# EasyEDA schematic SCH_RE2e-YM2151-v0.4_2024-08-24.json

## Sheets
1 BUS: TITLE: Sheet_2; REV: 1.0; Date: 2024-01-08; Sheet: 1/1; Drawn By: Denjhang; Company: Your Company
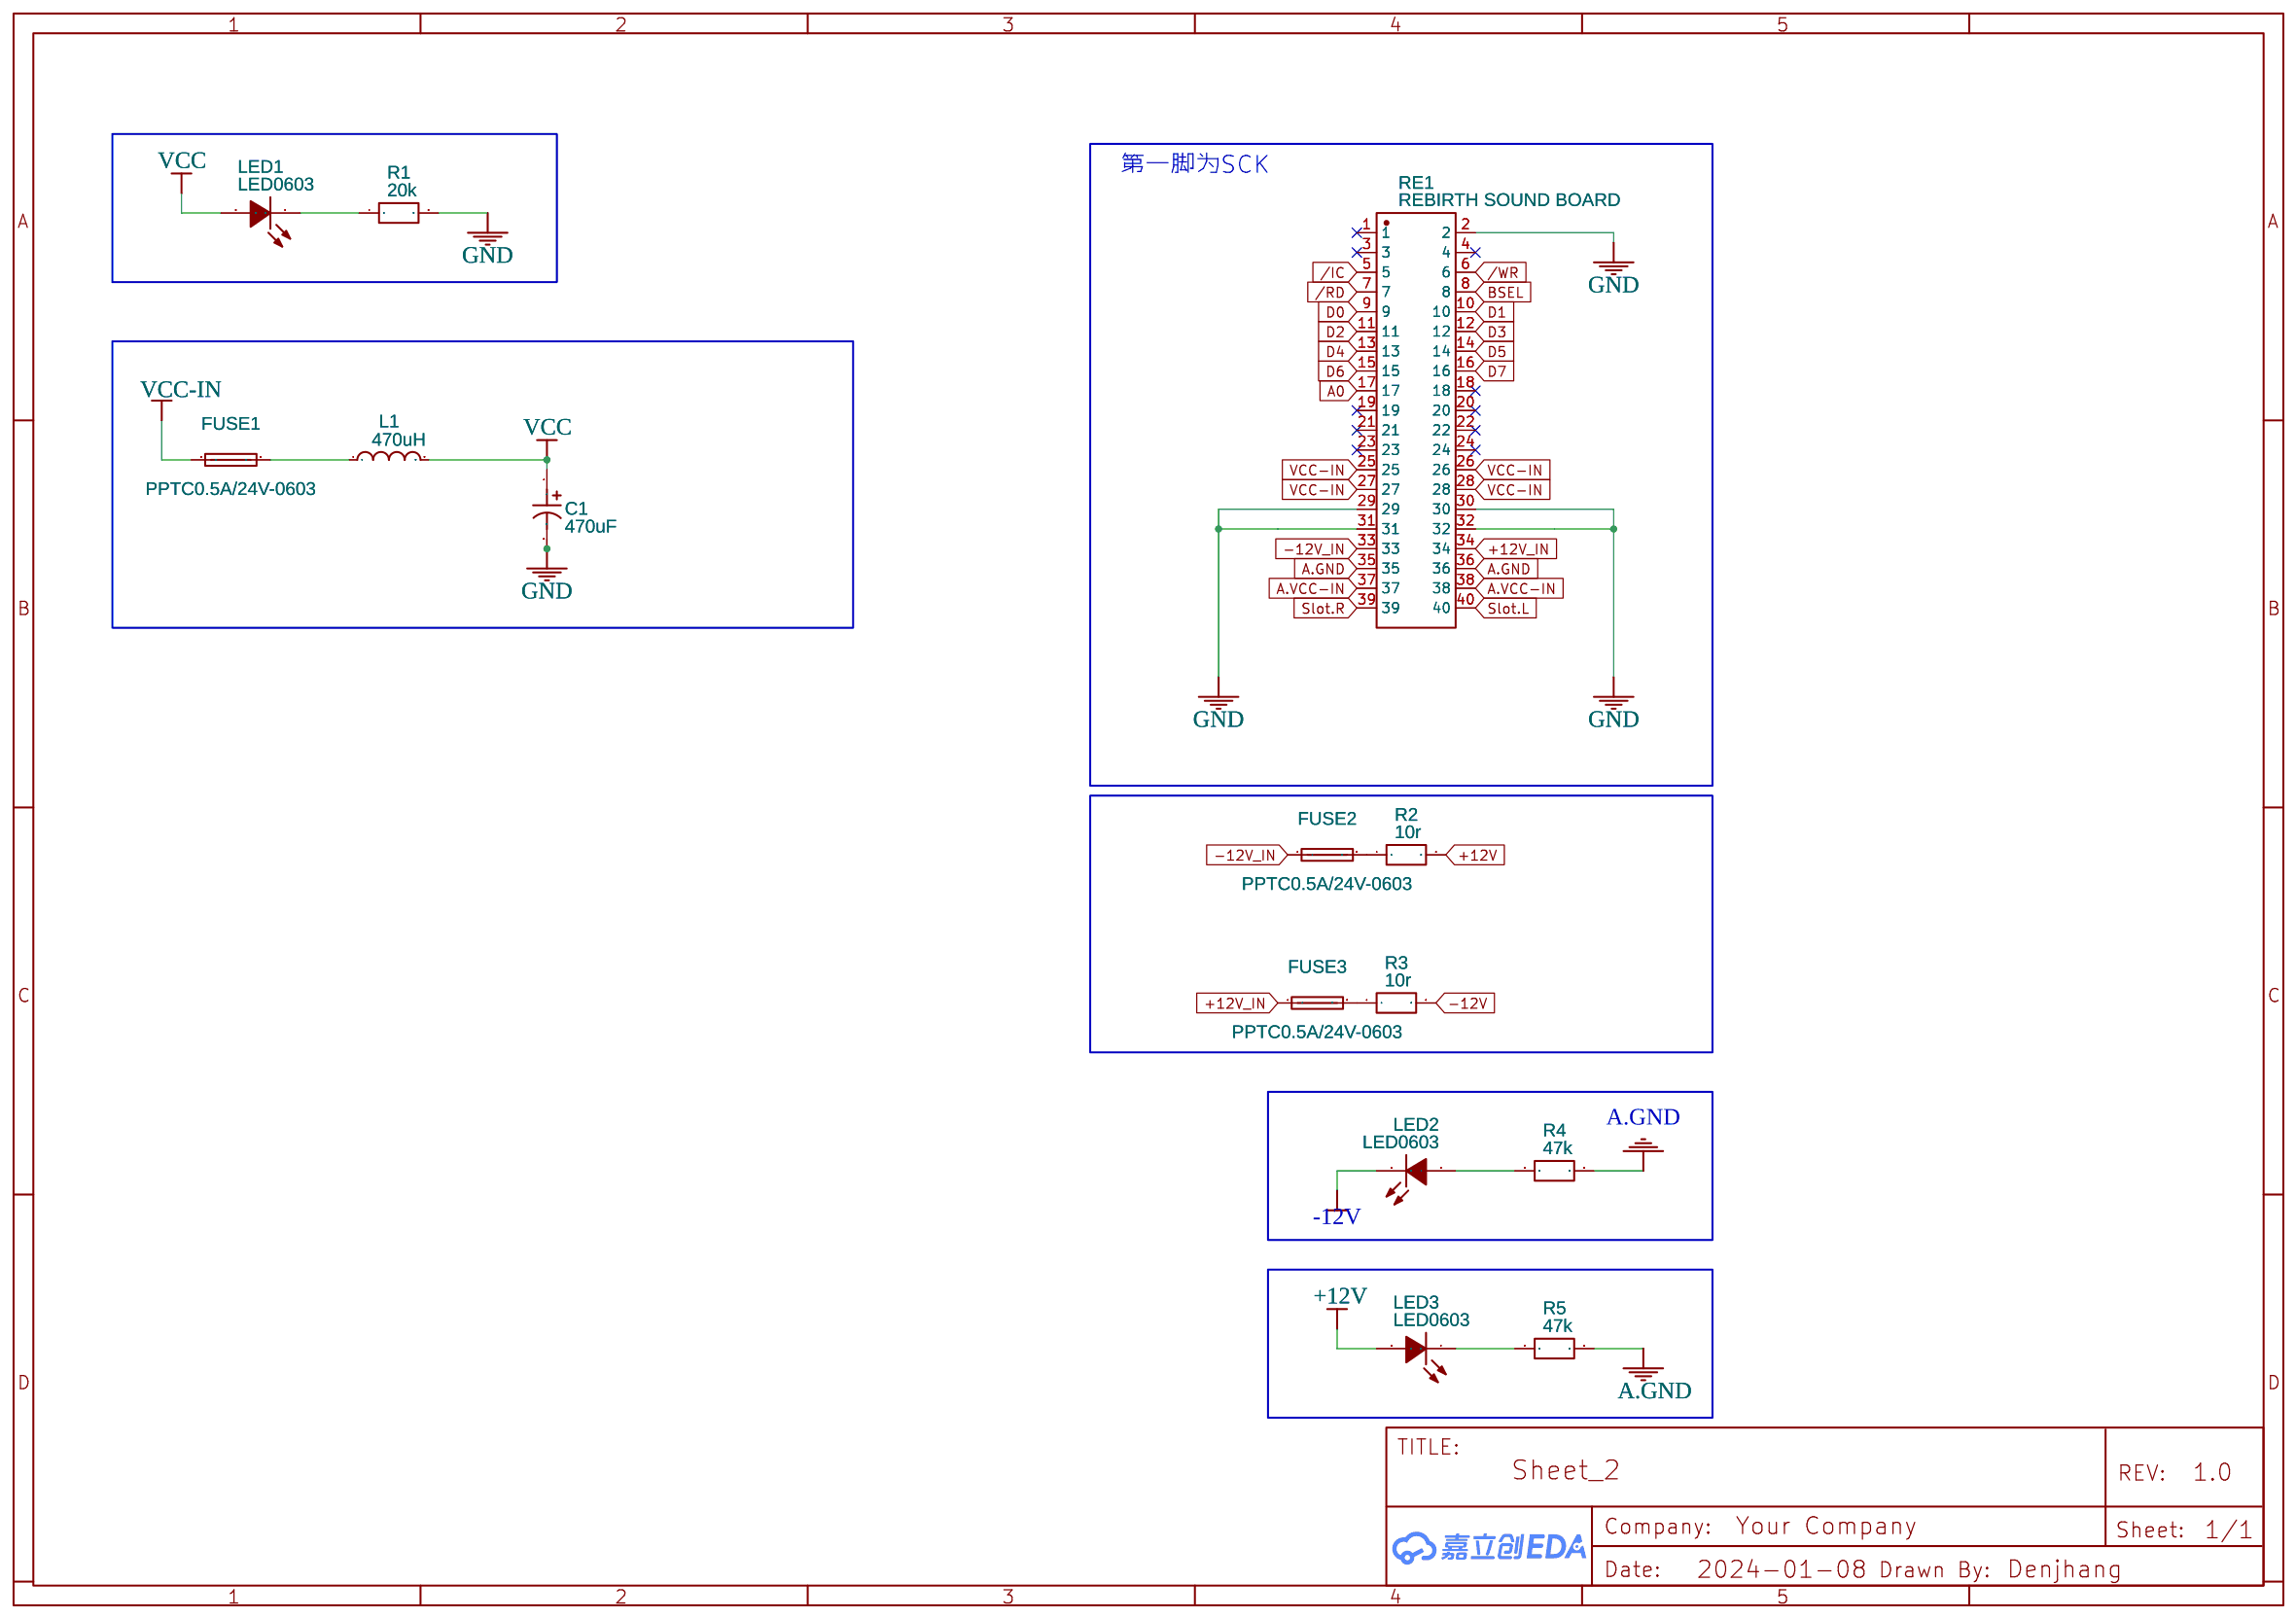
[diagram p0: BUS]
2 OPM: TITLE: Sheet_1
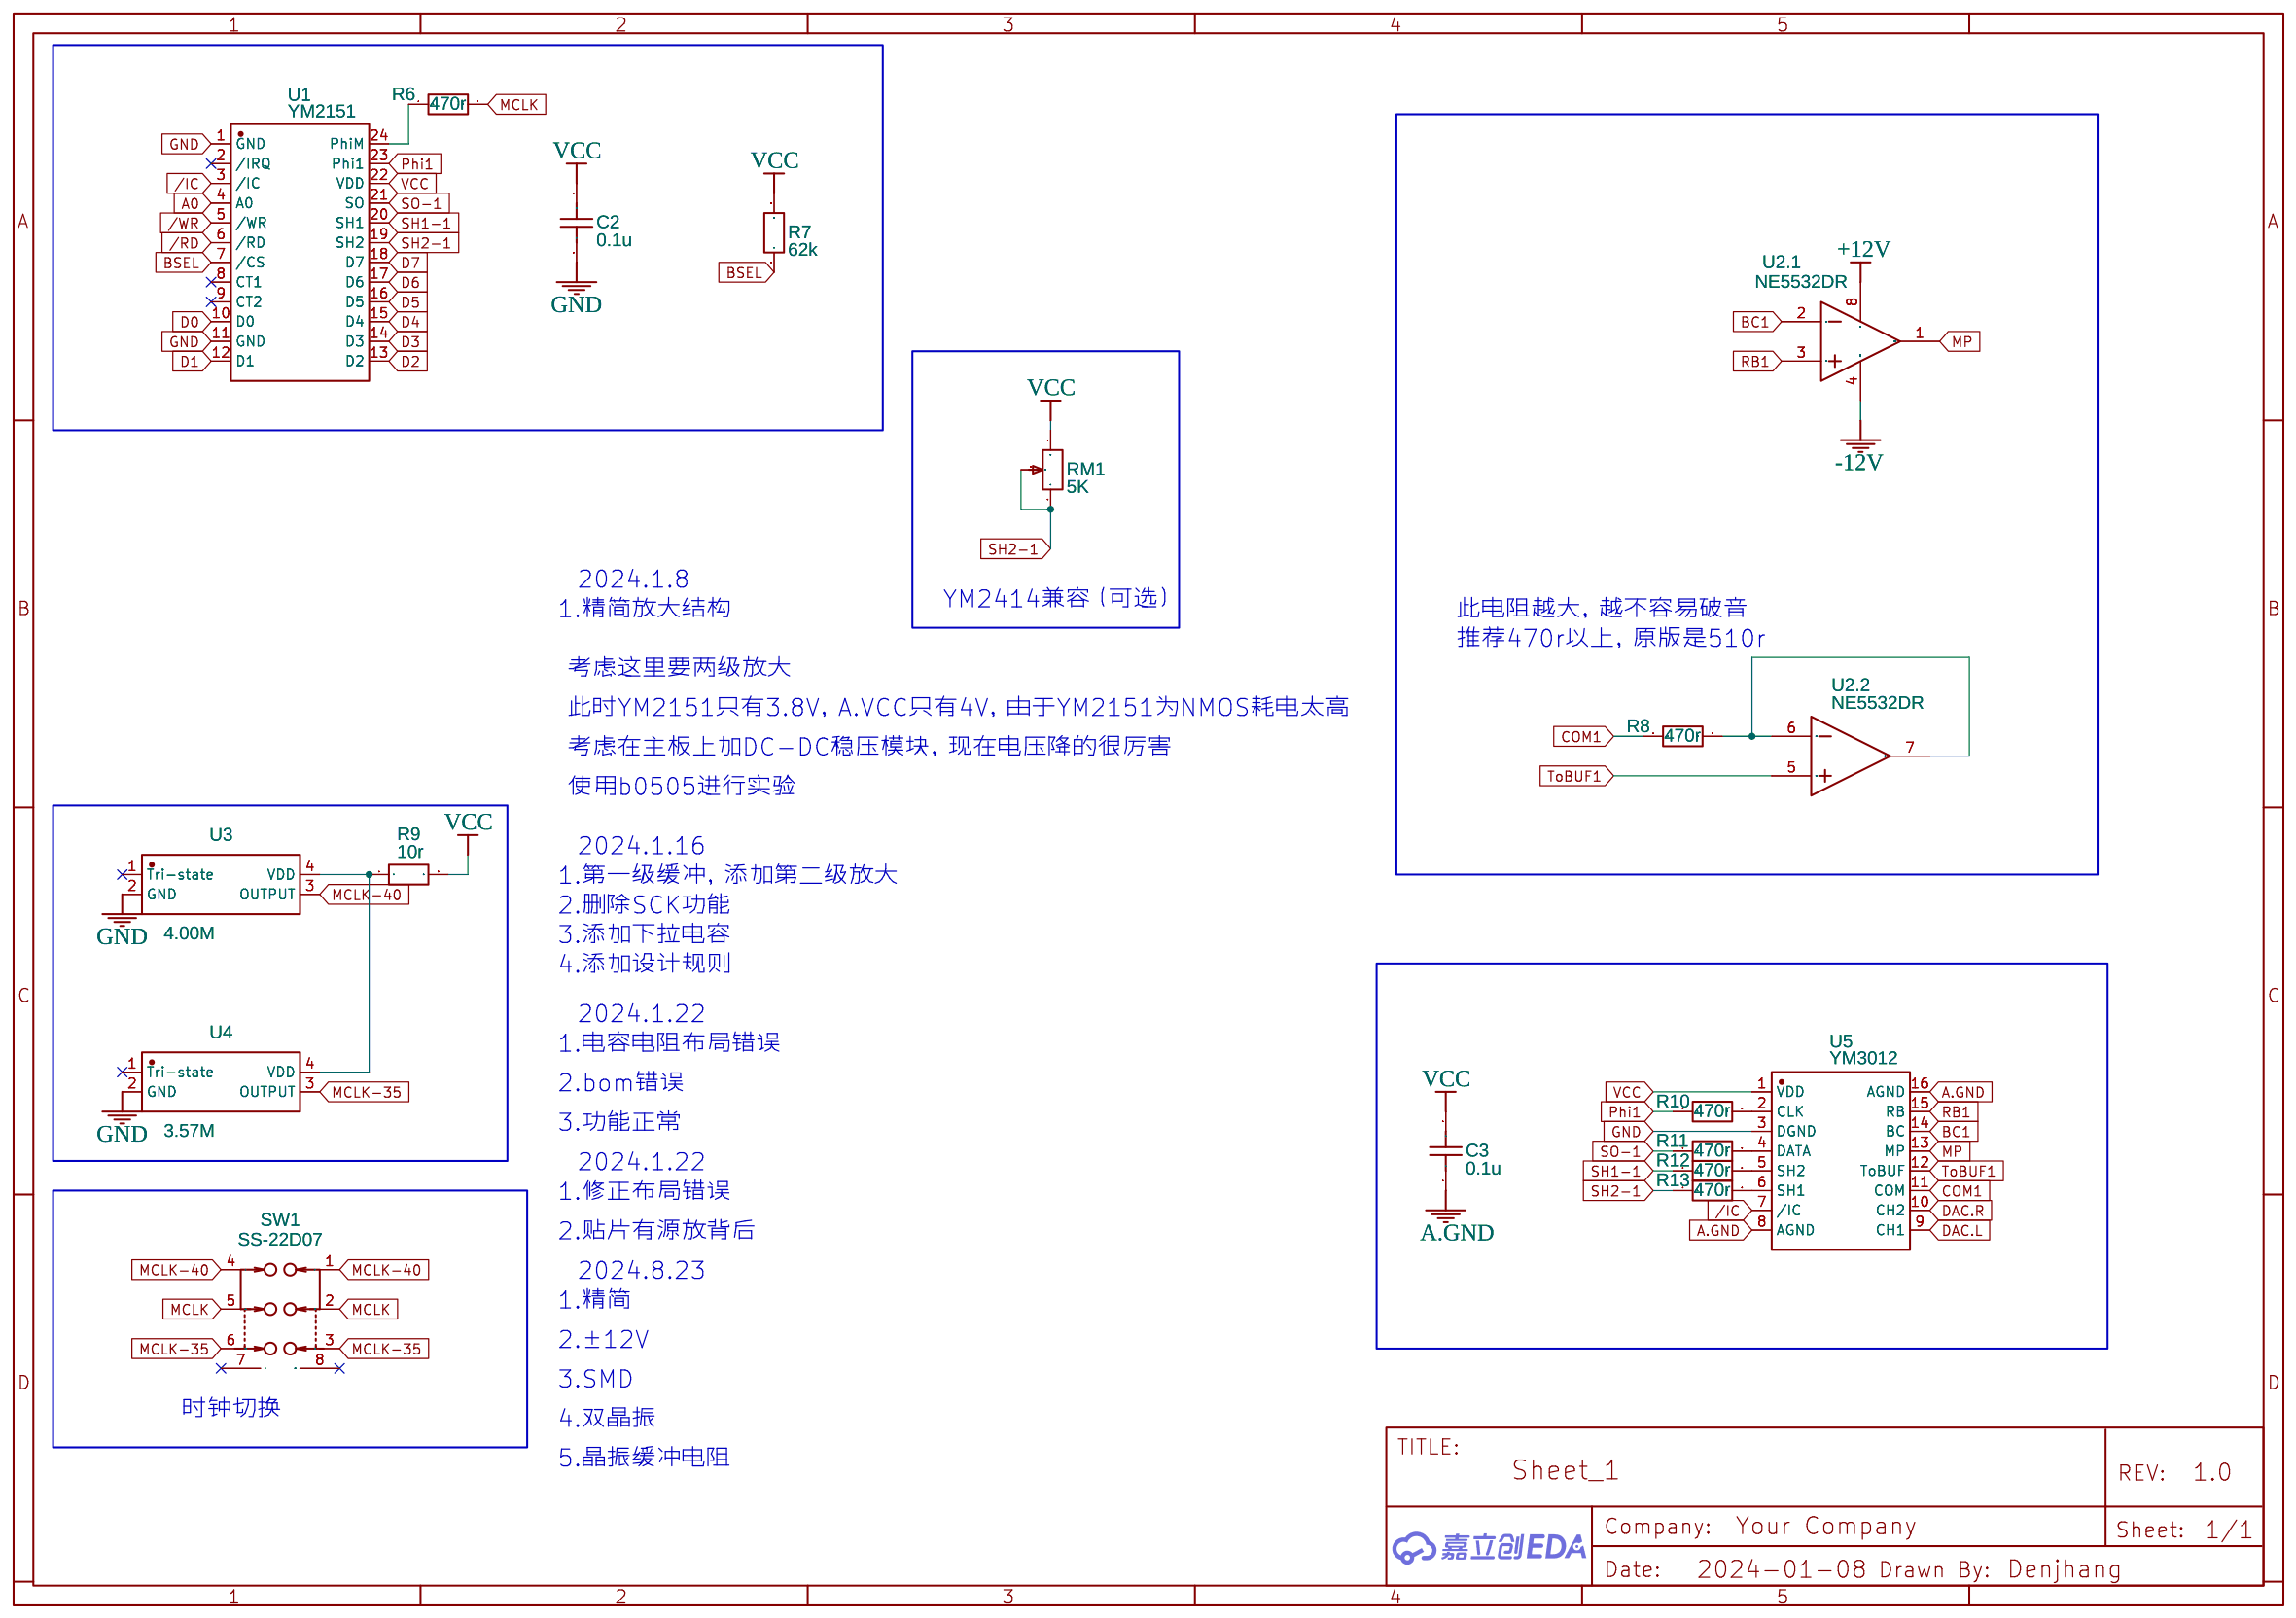
[diagram p1: OPM]
3 AMP1: TITLE: Sheet_1
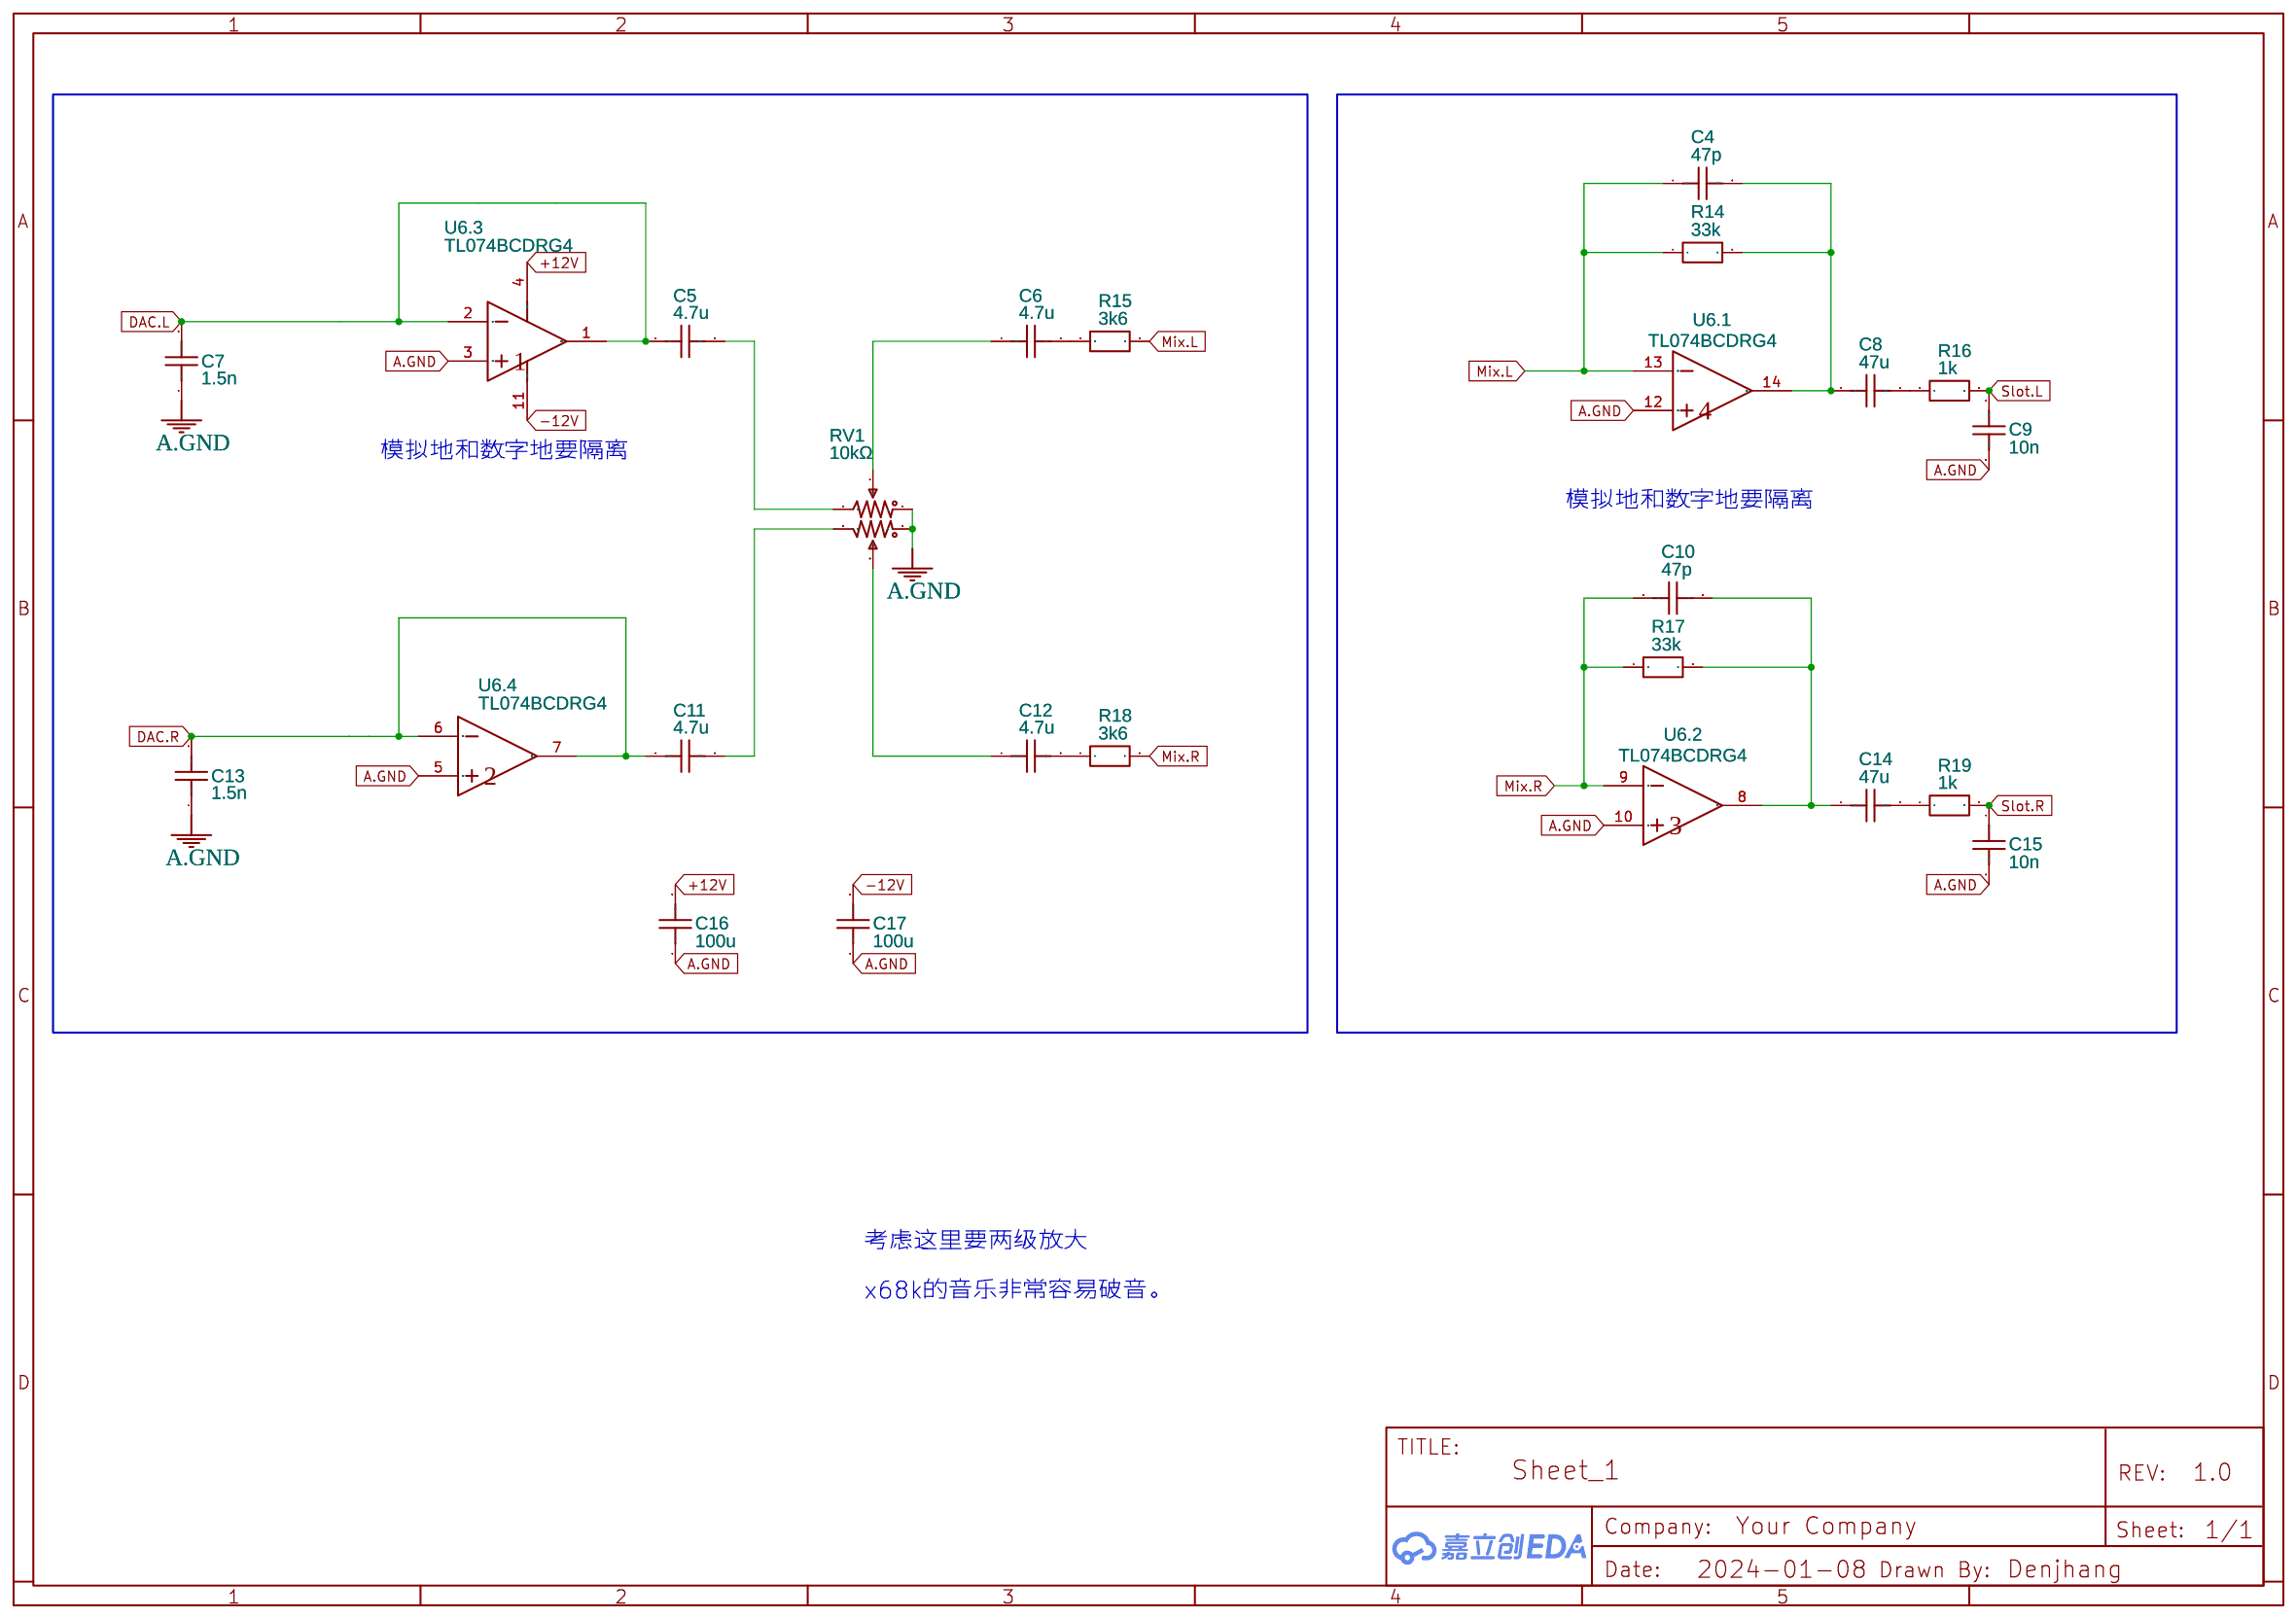
[diagram p2: AMP1]

## Parts
sheet AMP1
C4  47p  [C0603]
C5  4.7u  [C0603]
C6  4.7u  [C0603]
C7  1.5n  [C0603]
C8  47u  [C0805]
C9  10n  [C0603]
C10  47p  [C0603]
C11  4.7u  [C0603]
C12  4.7u  [C0603]
C13  1.5n  [C0603]
C14  47u  [C0805]
C15  10n  [C0603]
C16  100u  [C1206]
C17  100u  [C1206]
R14  33k  [R0603]
R15  3k6  [R0603]
R16  1k  [R0603]
R17  33k  [R0603]
R18  3k6  [R0603]
R19  1k  [R0603]
RV1  10kΩ  [RK097G-DJ]
U6  TL074BCDRG4  [SOIC-14_L8.6-W3.8-P1.27-LS6.0-BL]  (sections 1,2,3,4)
sheet BUS
C1  470uF  [CAP-SMD_BD6.3-L6.6-W6.6-FD]
FUSE1  PPTC0.5A/24V-0603  [F0603]
FUSE2  PPTC0.5A/24V-0603  [F0603]
FUSE3  PPTC0.5A/24V-0603  [F0603]
L1  470uH  [IND-SMD_L5.8-W5.2]
LED1  LED0603  [LED0603-RD]
LED2  LED0603  [LED0603-RD]
LED3  LED0603  [LED0603-RD]
R1  20k  [R0603]
R2  10r  [R0603]
R3  10r  [R0603]
R4  47k  [R0603]
R5  47k  [R0603]
RE1  REBIRTH SOUND BOARD  [REBIRTH SOUND BOARD]
sheet OPM
C2  0.1u  [C0603]
C3  0.1u  [C0603]
R6  470r  [R0603]
R7  62k  [R0603]
R8  470r  [R0603]
R9  10r  [R0603]
R10  470r  [R0603]
R11  470r  [R0603]
R12  470r  [R0603]
R13  470r  [R0603]
RM1  5K  [RES-ADJ-SMD_RM065-V1]
SW1  SS-22D07  [SW-TH_SS-22D07]
U1  YM2151  [DIP-24_L31.0-W13.5-P2.54-LS15.2-BL]
U2  NE5532DR  [SOIC-8_L4.9-W3.9-P1.27-LS6.0-BL]  (sections 1,2)
U3  4.00M  [OSC-SMD_4P-L3.2-W2.5-BL]
U4  3.57M  [OSC-SMD_4P-L3.2-W2.5-BL]
U5  YM3012  [DIP-16_L20.3-W10.2-P2.54-LS7.6-BL-2]

## Library data of the parts
C2-C7 C9-C13 C15 = C_0603_US: Contributor: LCEDA_Lib
C8 C14 = C_0805_US: Contributor: LCEDA_Lib
C16 C17 = C_1206_US: Contributor: LCEDA_Lib
R1-R19 = R_0603_EU: Contributor: LCEDA_Lib
RV1 = RK097-双连体: Contributor: LCSC; Supplier: LCSC; Supplier Part: C231763; Manufacturer: ALPSALPINE(阿尔卑斯阿尔派); Manufacturer Part: RK09712200MY; JLCPCB Part Class: Extended Part
U6 = TL074BCDRG4: subpart_no: 1; Supplier: LCSC; Supplier Part: C4370609; Manufacturer: TI(德州仪器); JLCPCB Part Class: Extended Part; link: https://so.szlcsc.com/global.html?k=C4370609&ref=editor
C1 = RVT220UF16V67RV0015: Contributor: LCSC; Supplier: LCSC; Supplier Part: C2887273; Manufacturer: KNSCHA(科尼盛); JLCPCB Part Class: Extended Part; link: https://so.szlcsc.com/global.html?k=C2887273&ref=editor
FUSE1-FUSE3 = PPTC0.5A/24V-0603: Contributor: LCSC; Supplier: LCSC; Supplier Part: C9900007586; Manufacturer: null; Manufacturer Part: PPTC0.5A/24V 自恢复保险丝-0603; JLCPCB Part Class: Extended Part
L1 = MSCD54-471KT: Contributor: LCSC; Supplier: LCSC; Supplier Part: C915206; Manufacturer: Meled(美莱); JLCPCB Part Class: Extended Part; link: https://so.szlcsc.com/global.html?k=C915206&ref=editor
LED1-LED3 = LED0603: Supplier: LCSC; Supplier Part: C2892154; Manufacturer: GBG; Manufacturer Part: GBG-C192KRKT; link: https://atta.szlcsc.comnull; Contributor: Denjhang
RE1 = REBIRTH SOUND BOARD: Contributor: lcsc; Supplier: LCSC; Supplier Part: C5242133; Manufacturer: XKB Connectivity(中国星坤); Manufacturer Part: X6522WR-2x20H-C60D30-E43F03
RM1 = RM065-DJ: Supplier: LCSC; Manufacturer: ReliaPro; Manufacturer Part: Blue and white adjustable resistance RM065-V1-102; Supplier Part: C53566; Contributor: Denjhang
SW1 = SS-22D07: Supplier Part: C34982; Supplier: LCSC; Manufacturer: ReliaPro; JLCPCB Part Class: Extended Part; link: https://so.szlcsc.com/global.html?k=C34982&ref=editor
U1 = YM2151: Contributor: Denjhang
U2 = NE5532DR: image: //image.lceda.cn/szlcsc/C7426.jpg; SMT Type: Basic; subpart_no: 2; Supplier: LCSC; Manufacturer: TI(德州仪器); LCSC Assembly: Yes; Supplier Part: C7426; JLCPCB Part Class: Basic Part; link: https://so.szlcsc.com/global.html?k=C7426&ref=editor
U3 U4 = OT32254MJBA4SL: Contributor: lcsc; Supplier: LCSC; Supplier Part: C2831397; Manufacturer: YXC(扬兴晶振); JLCPCB Part Class: Extended Part; link: https://so.szlcsc.com/global.html?k=C2831397&ref=editor
U5 = YM3012: Contributor: Denjhang

## Nets
+12V: C16.2 LED3.2(A) R2.2 U2.8(VCC+) U6.4(VCC)
+12V_IN: FUSE3.1 RE1.34
-12V: C17.2 LED2.1(C) R3.2 U2.4(VCC-/GND) U6.11(GND)
-12V_IN: FUSE2.1 RE1.33
GND: C1.2 C2.2 R1.2 RE1.2 RE1.29 RE1.30 RE1.31 RE1.32 U1.1(GND) U1.11(GND) U3.2(GND) U4.2(GND) U5.3(DGND)
VCC: C1.1 C2.1 C3.2 L1.2 LED1.2(A) R7.2 R9.2 RM1.3 U1.22(VDD) U5.1(VDD)
VCC-IN: FUSE1.1 RE1.25 RE1.26 RE1.27 RE1.28
/IC: RE1.5 U1.3(/IC) U5.7(/IC)
/RD: RE1.7 U1.6(/RD)
/WR: RE1.6 U1.5(/WR)
A0: RE1.17 U1.4(A0)
A.GND: C3.1 C7.1 C9.2 C13.1 C15.2 C16.1 C17.1 R4.2 R5.2 RE1.35 RE1.36 RV1.1 RV1.4 U5.8(AGND) U5.16(AGND) U6.3(IN1+) U6.5(IN2+) U6.10(IN3+) U6.12(IN4+)
A.VCC-IN: RE1.37 RE1.38
BC1: U2.2(IN1-) U5.14(BC)
BSEL: R7.1 RE1.8 U1.7(/CS)
COM1: R8.1 U5.11(COM)
D0: RE1.9 U1.10(D0)
D1: RE1.10 U1.12(D1)
D2: RE1.11 U1.13(D2)
D3: RE1.12 U1.14(D3)
D4: RE1.13 U1.15(D4)
D5: RE1.14 U1.16(D5)
D6: RE1.15 U1.17(D6)
D7: RE1.16 U1.18(D7)
DAC.L: C5.1 C7.2 U5.9(CH1) U6.1(OUT1) U6.2(IN1-)
DAC.R: C11.1 C13.2 U5.10(CH2) U6.6(IN2-) U6.7(OUT2)
MCLK: R6.2 SW1.2 SW1.5
MCLK-35: SW1.3 SW1.6 U4.3(OUTPUT)
MCLK-40: SW1.1 SW1.4 U3.3(OUTPUT)
Mix.L: C4.1 R14.1 R15.2 U6.13(IN4-)
Mix.R: C10.1 R17.1 R18.2 U6.9(IN3-)
MP: U2.1(OUT1) U5.13(MP)
Phi1: R10.1 U1.23(Phi1)
RB1: U2.3(IN1+) U5.15(RB)
SH1-1: R12.1 U1.20(SH1)
SH2-1: R13.1 RM1.1 RM1.2 U1.19(SH2)
Slot.L: C9.1 R16.2 RE1.40
Slot.R: C15.1 R19.2 RE1.39
SO-1: R11.1 U1.21(SO)
ToBUF1: U2.5(IN2+) U5.12(ToBUF)
Net-(C4-2): C4.2 C8.1 R14.2 U6.14(OUT4)
Net-(C5-2): C5.2 RV1.3
Net-(C6-1): C6.1 RV1.2
Net-(C6-2): C6.2 R15.1
Net-(C8-2): C8.2 R16.1
Net-(C10-2): C10.2 C14.1 R17.2 U6.8(OUT3)
Net-(C11-2): C11.2 RV1.6
Net-(C12-1): C12.1 RV1.5
Net-(C12-2): C12.2 R18.1
Net-(C14-2): C14.2 R19.1
Net-(FUSE1-2): FUSE1.2 L1.1
Net-(FUSE2-2): FUSE2.2 R2.1
Net-(FUSE3-2): FUSE3.2 R3.1
Net-(LED1-1): LED1.1(C) R1.1
Net-(LED2-2): LED2.2(A) R4.1
Net-(LED3-1): LED3.1(C) R5.1
Net-(R6-1): R6.1 U1.24(PhiM)
Net-(R8-2): R8.2 U2.6(IN2-) U2.7(OUT2)
Net-(R9-1): R9.1 U3.4(VDD) U4.4(VDD)
Net-(R10-2): R10.2 U5.2(CLK)
Net-(R11-2): R11.2 U5.4(DATA)
Net-(R12-2): R12.2 U5.5(SH2)
Net-(R13-2): R13.2 U5.6(SH1)

Not connected (* = marked no-connect by the designer): RE1 1* 3* 4* 18* 19* 20* 21* 22* 23* 24*; SW1 7* 8*; U1 2(/IRQ)* 8(CT1)* 9(CT2)*; U3 1(Tri-state)*; U4 1(Tri-state)*

## Notes on the sheets
sheet 1
- 第一脚为SCK
sheet 2
- 2024.1.8
- 1.精简放大结构
- YM2414兼容（可选）
- 此电阻越大，越不容易破音
- 推荐470r以上，原版是510r
- 考虑这里要两级放大
- 此时YM2151只有3.8V，A.VCC只有4V，由于YM2151为NMOS耗电太高
- 考虑在主板上加DC-DC稳压模块，现在电压降的很厉害
- 使用b0505进行实验
- 2024.1.16
- 1.第一级缓冲，添加第二级放大
- 2.删除SCK功能
- 3.添加下拉电容
- 4.添加设计规则
- 2024.1.22
- 1.电容电阻布局错误
- 2.bom错误
- 3.功能正常
- 2024.1.22
- 1.修正布局错误
- 2.贴片有源放背后
- 2024.8.23
- 1.精简
- 2.±12V
- 3.SMD
- 时钟切换
- 4.双晶振
- 5.晶振缓冲电阻
sheet 3
- 模拟地和数字地要隔离
- 模拟地和数字地要隔离
- 考虑这里要两级放大
- x68k的音乐非常容易破音。
